# EAGLE design lizard-ttl-register-4bit (EAGLE 6.4)
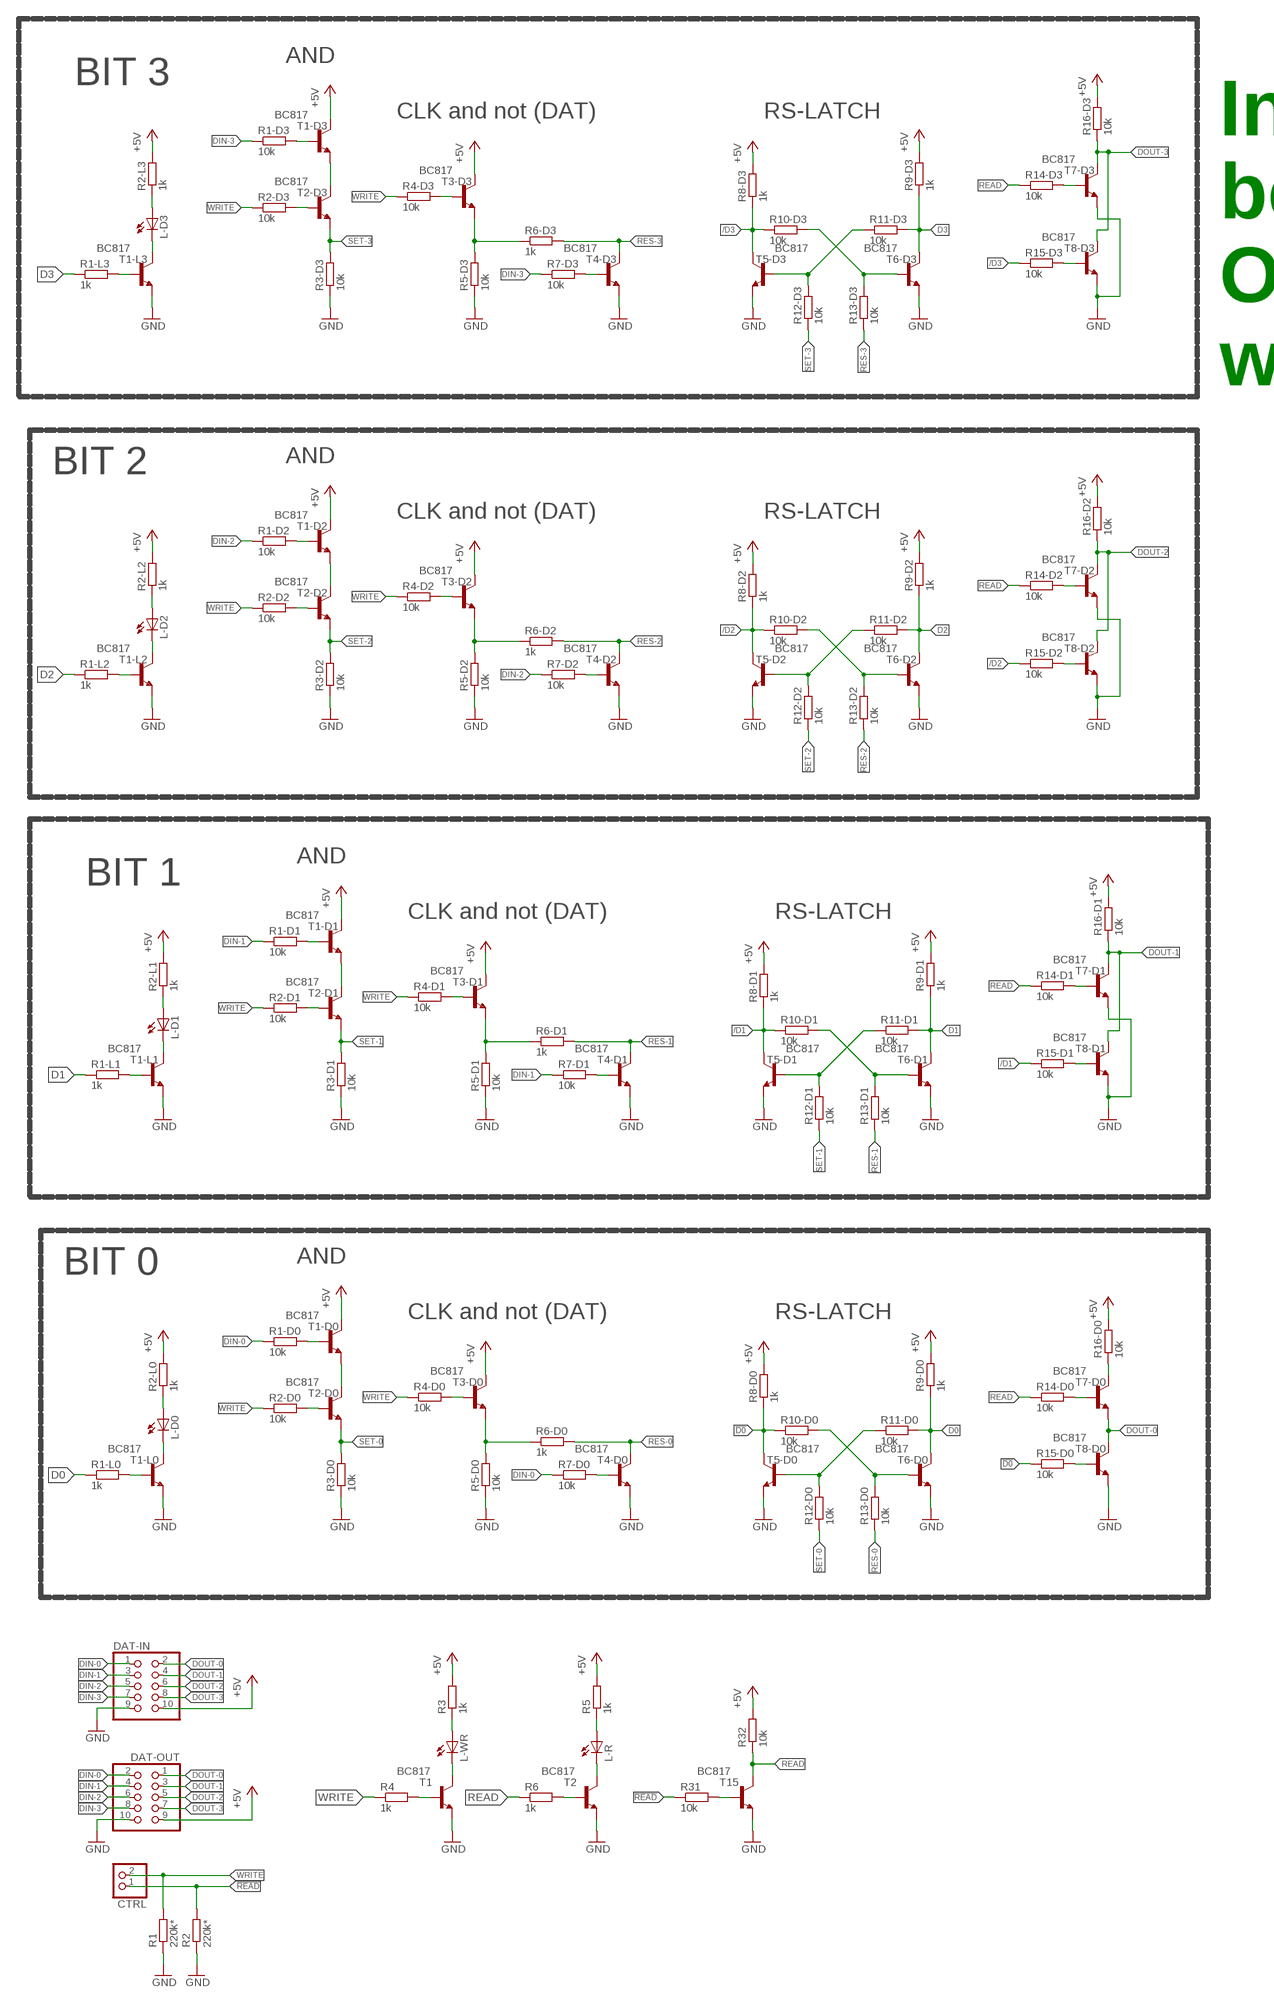
[diagram p0: schematic, sheet 1, part 1 of 2]
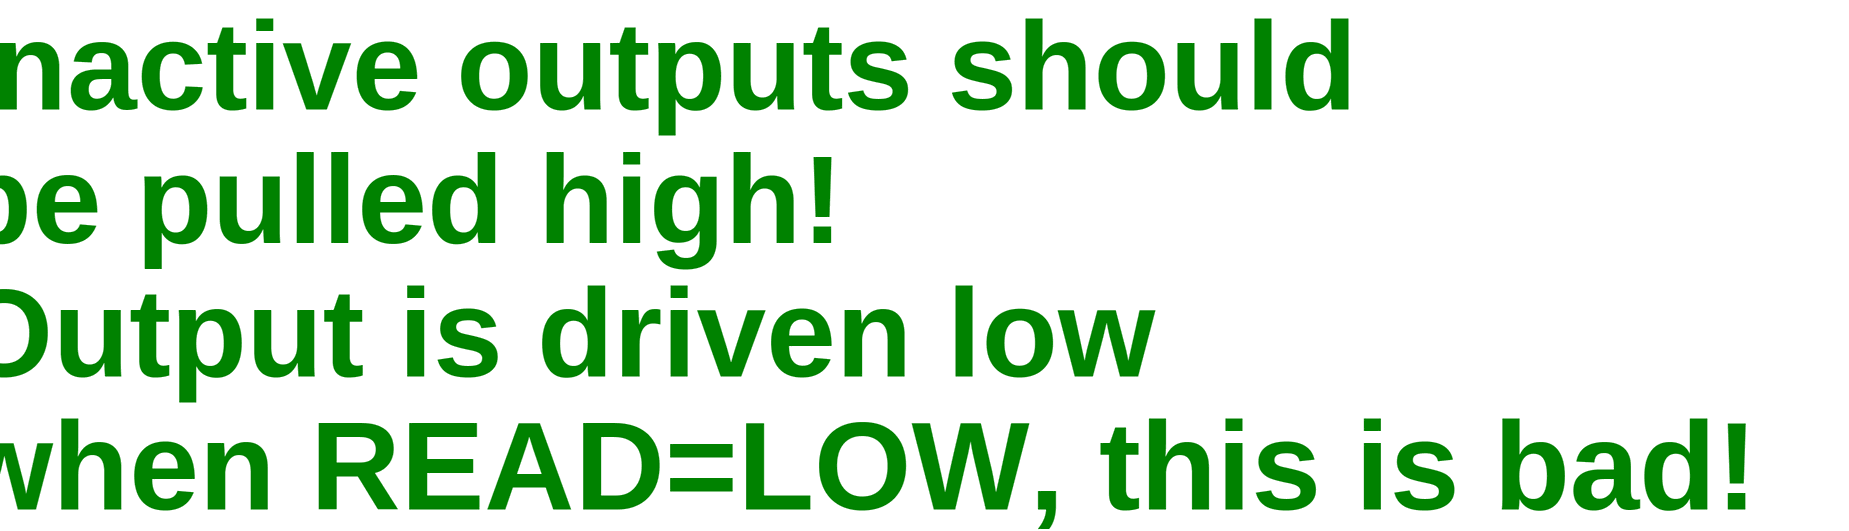
[diagram p1: schematic, sheet 1, part 2 of 2]

## Parts
CTRL  PINHD-1X2  [1X02]
DAT-IN  PINHD-2X5EDGE  [2X05/EDGE]
DAT-OUT  PINHD-2X5EDGE  [2X05/EDGE]
L-D0  LEDCHIPLED_0603  [CHIPLED_0603]
L-D1  LEDCHIPLED_0603  [CHIPLED_0603]
L-D2  LEDCHIPLED_0603  [CHIPLED_0603]
L-D3  LEDCHIPLED_0603  [CHIPLED_0603]
L-R  LEDCHIPLED_0603  [CHIPLED_0603]
L-WR  LEDCHIPLED_0603  [CHIPLED_0603]
R1  220k*  R-EU_R0603  [R0603]
R1-D0  10k  R-EU_R0603  [R0603]
R1-D1  10k  R-EU_R0603  [R0603]
R1-D2  10k  R-EU_R0603  [R0603]
R1-D3  10k  R-EU_R0603  [R0603]
R1-L0  1k  R-EU_R0603  [R0603]
R1-L1  1k  R-EU_R0603  [R0603]
R1-L2  1k  R-EU_R0603  [R0603]
R1-L3  1k  R-EU_R0603  [R0603]
R2  220k*  R-EU_R0603  [R0603]
R2-D0  10k  R-EU_R0603  [R0603]
R2-D1  10k  R-EU_R0603  [R0603]
R2-D2  10k  R-EU_R0603  [R0603]
R2-D3  10k  R-EU_R0603  [R0603]
R2-L0  1k  R-EU_R0603  [R0603]
R2-L1  1k  R-EU_R0603  [R0603]
R2-L2  1k  R-EU_R0603  [R0603]
R2-L3  1k  R-EU_R0603  [R0603]
R3  1k  R-EU_R0603  [R0603]
R3-D0  10k  R-EU_R0603  [R0603]
R3-D1  10k  R-EU_R0603  [R0603]
R3-D2  10k  R-EU_R0603  [R0603]
R3-D3  10k  R-EU_R0603  [R0603]
R4  1k  R-EU_R0603  [R0603]
R4-D0  10k  R-EU_R0603  [R0603]
R4-D1  10k  R-EU_R0603  [R0603]
R4-D2  10k  R-EU_R0603  [R0603]
R4-D3  10k  R-EU_R0603  [R0603]
R5  1k  R-EU_R0603  [R0603]
R5-D0  10k  R-EU_R0603  [R0603]
R5-D1  10k  R-EU_R0603  [R0603]
R5-D2  10k  R-EU_R0603  [R0603]
R5-D3  10k  R-EU_R0603  [R0603]
R6  1k  R-EU_R0603  [R0603]
R6-D0  1k  R-EU_R0603  [R0603]
R6-D1  1k  R-EU_R0603  [R0603]
R6-D2  1k  R-EU_R0603  [R0603]
R6-D3  1k  R-EU_R0603  [R0603]
R7-D0  10k  R-EU_R0603  [R0603]
R7-D1  10k  R-EU_R0603  [R0603]
R7-D2  10k  R-EU_R0603  [R0603]
R7-D3  10k  R-EU_R0603  [R0603]
R8-D0  1k  R-EU_R0603  [R0603]
R8-D1  1k  R-EU_R0603  [R0603]
R8-D2  1k  R-EU_R0603  [R0603]
R8-D3  1k  R-EU_R0603  [R0603]
R9-D0  1k  R-EU_R0603  [R0603]
R9-D1  1k  R-EU_R0603  [R0603]
R9-D2  1k  R-EU_R0603  [R0603]
R9-D3  1k  R-EU_R0603  [R0603]
R10-D0  10k  R-EU_R0603  [R0603]
R10-D1  10k  R-EU_R0603  [R0603]
R10-D2  10k  R-EU_R0603  [R0603]
R10-D3  10k  R-EU_R0603  [R0603]
R11-D0  10k  R-EU_R0603  [R0603]
R11-D1  10k  R-EU_R0603  [R0603]
R11-D2  10k  R-EU_R0603  [R0603]
R11-D3  10k  R-EU_R0603  [R0603]
R12-D0  10k  R-EU_R0603  [R0603]
R12-D1  10k  R-EU_R0603  [R0603]
R12-D2  10k  R-EU_R0603  [R0603]
R12-D3  10k  R-EU_R0603  [R0603]
R13-D0  10k  R-EU_R0603  [R0603]
R13-D1  10k  R-EU_R0603  [R0603]
R13-D2  10k  R-EU_R0603  [R0603]
R13-D3  10k  R-EU_R0603  [R0603]
R14-D0  10k  R-EU_R0603  [R0603]
R14-D1  10k  R-EU_R0603  [R0603]
R14-D2  10k  R-EU_R0603  [R0603]
R14-D3  10k  R-EU_R0603  [R0603]
R15-D0  10k  R-EU_R0603  [R0603]
R15-D1  10k  R-EU_R0603  [R0603]
R15-D2  10k  R-EU_R0603  [R0603]
R15-D3  10k  R-EU_R0603  [R0603]
R16-D0  10k  R-EU_R0603  [R0603]
R16-D1  10k  R-EU_R0603  [R0603]
R16-D2  10k  R-EU_R0603  [R0603]
R16-D3  10k  R-EU_R0603  [R0603]
R31  10k  R-EU_R0603  [R0603]
R32  10k  R-EU_R0603  [R0603]
T1  BC817  BC817-40-NPN-SOT23-BEC  [SOT23-BEC]
T1-D0  BC817  BC817-40-NPN-SOT23-BEC  [SOT23-BEC]
T1-D1  BC817  BC817-40-NPN-SOT23-BEC  [SOT23-BEC]
T1-D2  BC817  BC817-40-NPN-SOT23-BEC  [SOT23-BEC]
T1-D3  BC817  BC817-40-NPN-SOT23-BEC  [SOT23-BEC]
T1-L0  BC817  BC817-40-NPN-SOT23-BEC  [SOT23-BEC]
T1-L1  BC817  BC817-40-NPN-SOT23-BEC  [SOT23-BEC]
T1-L2  BC817  BC817-40-NPN-SOT23-BEC  [SOT23-BEC]
T1-L3  BC817  BC817-40-NPN-SOT23-BEC  [SOT23-BEC]
T2  BC817  BC817-40-NPN-SOT23-BEC  [SOT23-BEC]
T2-D0  BC817  BC817-40-NPN-SOT23-BEC  [SOT23-BEC]
T2-D1  BC817  BC817-40-NPN-SOT23-BEC  [SOT23-BEC]
T2-D2  BC817  BC817-40-NPN-SOT23-BEC  [SOT23-BEC]
T2-D3  BC817  BC817-40-NPN-SOT23-BEC  [SOT23-BEC]
T3-D0  BC817  BC817-40-NPN-SOT23-BEC  [SOT23-BEC]
T3-D1  BC817  BC817-40-NPN-SOT23-BEC  [SOT23-BEC]
T3-D2  BC817  BC817-40-NPN-SOT23-BEC  [SOT23-BEC]
T3-D3  BC817  BC817-40-NPN-SOT23-BEC  [SOT23-BEC]
T4-D0  BC817  BC817-40-NPN-SOT23-BEC  [SOT23-BEC]
T4-D1  BC817  BC817-40-NPN-SOT23-BEC  [SOT23-BEC]
T4-D2  BC817  BC817-40-NPN-SOT23-BEC  [SOT23-BEC]
T4-D3  BC817  BC817-40-NPN-SOT23-BEC  [SOT23-BEC]
T5-D0  BC817  BC817-40-NPN-SOT23-BEC  [SOT23-BEC]
T5-D1  BC817  BC817-40-NPN-SOT23-BEC  [SOT23-BEC]
T5-D2  BC817  BC817-40-NPN-SOT23-BEC  [SOT23-BEC]
T5-D3  BC817  BC817-40-NPN-SOT23-BEC  [SOT23-BEC]
T6-D0  BC817  BC817-40-NPN-SOT23-BEC  [SOT23-BEC]
T6-D1  BC817  BC817-40-NPN-SOT23-BEC  [SOT23-BEC]
T6-D2  BC817  BC817-40-NPN-SOT23-BEC  [SOT23-BEC]
T6-D3  BC817  BC817-40-NPN-SOT23-BEC  [SOT23-BEC]
T7-D0  BC817  BC817-40-NPN-SOT23-BEC  [SOT23-BEC]
T7-D1  BC817  BC817-40-NPN-SOT23-BEC  [SOT23-BEC]
T7-D2  BC817  BC817-40-NPN-SOT23-BEC  [SOT23-BEC]
T7-D3  BC817  BC817-40-NPN-SOT23-BEC  [SOT23-BEC]
T8-D0  BC817  BC817-40-NPN-SOT23-BEC  [SOT23-BEC]
T8-D1  BC817  BC817-40-NPN-SOT23-BEC  [SOT23-BEC]
T8-D2  BC817  BC817-40-NPN-SOT23-BEC  [SOT23-BEC]
T8-D3  BC817  BC817-40-NPN-SOT23-BEC  [SOT23-BEC]
T15  BC817  BC817-40-NPN-SOT23-BEC  [SOT23-BEC]

## Nets
!D0: R8-D0.1 R10-D0.1 R15-D0.1 T5-D0.C
!READ: CTRL.1 R2.2 R31.1
+5V: DAT-IN.10 DAT-OUT.9 R2-L0.2 R2-L1.2 R2-L2.2 R2-L3.2 R3.2 R5.2 R8-D0.2 R8-D1.2 R8-D2.2 R8-D3.2 R9-D0.2 R9-D1.2 R9-D2.2 R9-D3.2 R16-D0.2 R16-D1.2 R16-D2.2 R16-D3.2 R32.2 T1-D0.C T1-D1.C T1-D2.C T1-D3.C T3-D0.C T3-D1.C T3-D2.C T3-D3.C
/D1: R8-D1.1 R10-D1.1 R15-D1.1 T5-D1.C
/D2: R8-D2.1 R10-D2.1 R15-D2.1 T5-D2.C
/D3: R8-D3.1 R10-D3.1 R15-D3.1 T5-D3.C
D0: R1-L0.1 R9-D0.1 R11-D0.2 T6-D0.C
D1: R1-L1.1 R9-D1.1 R11-D1.2 T6-D1.C
D2: R1-L2.1 R9-D2.1 R11-D2.2 T6-D2.C
D3: R1-L3.1 R9-D3.1 R11-D3.2 T6-D3.C
DIN-0: DAT-IN.1 DAT-OUT.2 R1-D0.1 R7-D0.1
DIN-1: DAT-IN.3 DAT-OUT.4 R1-D1.1 R7-D1.1
DIN-2: DAT-IN.5 DAT-OUT.6 R1-D2.1 R7-D2.1
DIN-3: DAT-IN.7 DAT-OUT.8 R1-D3.1 R7-D3.1
DOUT-0: DAT-IN.2 DAT-OUT.1 T7-D0.E T8-D0.C
DOUT-1: DAT-IN.4 DAT-OUT.3 R16-D1.1 T7-D1.C T8-D1.C
DOUT-2: DAT-IN.6 DAT-OUT.5 R16-D2.1 T7-D2.C T8-D2.C
DOUT-3: DAT-IN.8 DAT-OUT.7 R16-D3.1 T7-D3.C T8-D3.C
GND: DAT-IN.9 DAT-OUT.10 R1.1 R2.1 R3-D0.1 R3-D1.1 R3-D2.1 R3-D3.1 R5-D0.1 R5-D1.1 R5-D2.1 R5-D3.1 T1-L0.E T1-L1.E T1-L2.E T1-L3.E T1.E T2.E T4-D0.E T4-D1.E T4-D2.E T4-D3.E T5-D0.E T5-D1.E T5-D2.E T5-D3.E T6-D0.E T6-D1.E T6-D2.E T6-D3.E T7-D1.E T7-D2.E T7-D3.E T8-D0.E T8-D1.E T8-D2.E T8-D3.E T15.E
N$1: T1-D0.E T2-D0.C
N$2: R7-D0.2 T4-D0.B
N$3: R1-L1.2 T1-L1.B
N$4: R4.2 T1.B
N$5: L-WR.A R3.1
N$6: L-WR.C T1.C
N$7: R6.2 T2.B
N$8: L-R.A R5.1
N$9: L-R.C T2.C
N$10: R1-L0.2 T1-L0.B
N$11: L-D0.A R2-L0.1
N$12: L-D0.C T1-L0.C
N$13: L-D1.A R2-L1.1
N$14: R1-D0.2 T1-D0.B
N$15: R2-D0.2 T2-D0.B
N$16: R11-D0.1 R12-D0.2 T5-D0.B
N$17: R10-D0.2 R13-D0.2 T6-D0.B
N$18: L-D1.C T1-L1.C
N$19: R5-D0.2 R6-D0.1 T3-D0.E
N$20: R1-D1.2 T1-D1.B
N$21: R2-D1.2 T2-D1.B
N$22: R5-D1.2 R6-D1.1 T3-D1.E
N$23: R4-D0.2 T3-D0.B
N$24: R4-D1.2 T3-D1.B
N$25: T1-D1.E T2-D1.C
N$26: R7-D1.2 T4-D1.B
N$27: R14-D0.2 T7-D0.B
N$28: R15-D0.2 T8-D0.B
N$29: R31.2 T15.B
N$30: R11-D1.1 R12-D1.2 T5-D1.B
N$31: R10-D1.2 R13-D1.2 T6-D1.B
N$32: R14-D1.2 T7-D1.B
N$33: R15-D1.2 T8-D1.B
N$34: R1-L2.2 T1-L2.B
N$35: L-D2.A R2-L2.1
N$36: L-D2.C T1-L2.C
N$37: R1-D2.2 T1-D2.B
N$38: R2-D2.2 T2-D2.B
N$39: R5-D2.2 R6-D2.1 T3-D2.E
N$40: R4-D2.2 T3-D2.B
N$41: T1-D2.E T2-D2.C
N$42: R7-D2.2 T4-D2.B
N$43: R11-D2.1 R12-D2.2 T5-D2.B
N$44: R10-D2.2 R13-D2.2 T6-D2.B
N$45: R14-D2.2 T7-D2.B
N$46: R15-D2.2 T8-D2.B
N$47: R1-L3.2 T1-L3.B
N$48: L-D3.A R2-L3.1
N$49: L-D3.C T1-L3.C
N$50: R1-D3.2 T1-D3.B
N$51: R2-D3.2 T2-D3.B
N$52: R5-D3.2 R6-D3.1 T3-D3.E
N$53: R4-D3.2 T3-D3.B
N$54: T1-D3.E T2-D3.C
N$55: R7-D3.2 T4-D3.B
N$56: R11-D3.1 R12-D3.2 T5-D3.B
N$57: R10-D3.2 R13-D3.2 T6-D3.B
N$58: R14-D3.2 T7-D3.B
N$59: R15-D3.2 T8-D3.B
N$61: R16-D0.1 T7-D0.C
READ: R6.1 R14-D0.1 R14-D1.1 R14-D2.1 R14-D3.1 R32.1 T15.C
RES-0: R6-D0.2 R13-D0.1 T4-D0.C
RES-1: R6-D1.2 R13-D1.1 T4-D1.C
RES-2: R6-D2.2 R13-D2.1 T4-D2.C
RES-3: R6-D3.2 R13-D3.1 T4-D3.C
SET-0: R3-D0.2 R12-D0.1 T2-D0.E
SET-1: R3-D1.2 R12-D1.1 T2-D1.E
SET-2: R3-D2.2 R12-D2.1 T2-D2.E
SET-3: R3-D3.2 R12-D3.1 T2-D3.E
WRITE: CTRL.2 R1.2 R2-D0.1 R2-D1.1 R2-D2.1 R2-D3.1 R4-D0.1 R4-D1.1 R4-D2.1 R4-D3.1 R4.1

## Notes on the sheet
- AND
- BIT 3
- CLK and not (DAT) | RS-LATCH
- Inactive outputs should
  be pulled high!
  Output is driven low
  when READ=LOW, this is bad!
- AND
- BIT 2
- CLK and not (DAT) | RS-LATCH
- AND
- BIT 1
- CLK and not (DAT) | RS-LATCH
- AND
- BIT 0
- CLK and not (DAT) | RS-LATCH

## Library data of the parts
CTRL = pinhead:PINHD-1X2: PIN HEADER
DAT-IN DAT-OUT = pinhead-mod:PINHD-2X5: PIN HEADER
L-D0 L-D1-L-D3 L-R L-WR = led:LED: LED OSRAM: - CHIPLED LG R971, LG N971, LY N971, LG Q971, LY Q971, LO R971, LY R971 LH N974, LH R974 LS Q976, LO Q976, LY Q976 LO Q996 - Hyper CHIPLED LW Q18S LB Q993, LB Q99A, LB R99A - SideLED LS A670, LO A670, LY A670, LG A670, LP A670 LB A673, LV A673, LT A673, LW A673 LH A674 LY A675 LS A676, LA A676, LO A676, LY A676, LW A676 LS A679, LY A679, LG A679 - Hyper Micro SIDELED® LS Y876, LA Y876, LO Y876, LY Y876 LT Y87S - SmartLED LW L88C, LW L88S LB L89C, LB L89S, LG L890 LS L89K, LO L89K, LY L89K LS L896, LA L896, LO L896, LY L896 - TOPLED LS T670, LO T670, LY T670, LG T670, LP T670 LSG T670, LSP T670, LSY T670, LOP T670, LYG T670 LG T671, LOG T671, LSG T671 LB T673, LV T673, LT T673, LW T673 LH T674 LS T676, LA T676, LO T676, LY T676, LB T676, LH T676, LSB T676, LW T676 LB T67C, LV T67C, LT T67C, LS T67K, LO T67K, LY T67K, LW E67C LS E67B, LA E67B, LO E67B, LY E67B, LB E67C, LV E67C, LT E67C LW T67C LS T679, LY T679, LG T679 LS T770, LO T770, LY T770, LG T770, LP T770 LB T773, LV T773, LT T773, LW T773 LH T774 LS E675, LA E675, LY E675, LS T675 LS T776, LA T776, LO T776, LY T776, LB T776 LHGB T686 LT T68C, LB T68C - Hyper Mini TOPLED® LB M676 - Mini TOPLED Santana® LG M470 LS M47K, LO M47K, LY M47K Source: http://www.osram.convergy.de LUXEON: - LUMILED® LXK2-PW12-R00, LXK2-PW12-S00, LXK2-PW14-U00, LXK2-PW14-V00 LXK2-PM12-R00, LXK2-PM12-S00, LXK2-PM14-U00 LXK2-PE12-Q00, LXK2-PE12-R00, LXK2-PE12-S00, LXK2-PE14-T00, LXK2-PE14-U00 LXK2-PB12-K00, LXK2-PB12-L00, LXK2-PB12-M00, LXK2-PB14-N00, LXK2-PB14-P00, LXK2-PB14-Q00 LXK2-PR12-L00, LXK2-PR12-M00, LXK2-PR14-Q00, LXK2-PR14-R00 LXK2-PD12-Q00, LXK2-PD12-R00, LXK2-PD12-S00 LXK2-PH12-R00, LXK2-PH12-S00 LXK2-PL12-P00, LXK2-PL12-Q00, LXK2-PL12-R00 Source: www.luxeon.com KINGBRIGHT: KA-3528ASYC Source: www.kingbright.com
R1 R1-D0 R1-D1-R1-D3 R1-L0 R1-L1-R1-L3 R2 R2-D0 R2-D1-R2-D3 R2-L0 R2-L1-R2-L3 R3 R3-D0 R3-D1-R3-D3 R4 R4-D0 R4-D1-R4-D3 R5 R5-D0 R5-D1-R5-D3 R6 R6-D0 R6-D1-R6-D3 R7-D0 R7-D1-R7-D3 R8-D0 R8-D1-R8-D3 R9-D0 R9-D1-R9-D3 R10-D0 R10-D1-R10-D3 R11-D0 R11-D1-R11-D3 R12-D0 R12-D1-R12-D3 R13-D0 R13-D1-R13-D3 R14-D0 R14-D1-R14-D3 R15-D0 R15-D1-R15-D3 R16-D0 R16-D1-R16-D3 R31 R32 = p.peter-rcl:R-EU_: RESISTOR, European symbol
T1 T1-D0 T1-D1-T1-D3 T1-L0 T1-L1-T1-L3 T2 T2-D0 T2-D1-T2-D3 T3-D0 T3-D1-T3-D3 T4-D0 T4-D1-T4-D3 T5-D0 T5-D1-T5-D3 T6-D0 T6-D1-T6-D3 T7-D0 T7-D1-T7-D3 T8-D0 T8-D1-T8-D3 T15 = transistor:*-NPN-: NPN Transistror BF959 corrected 2008.03.06

## Board
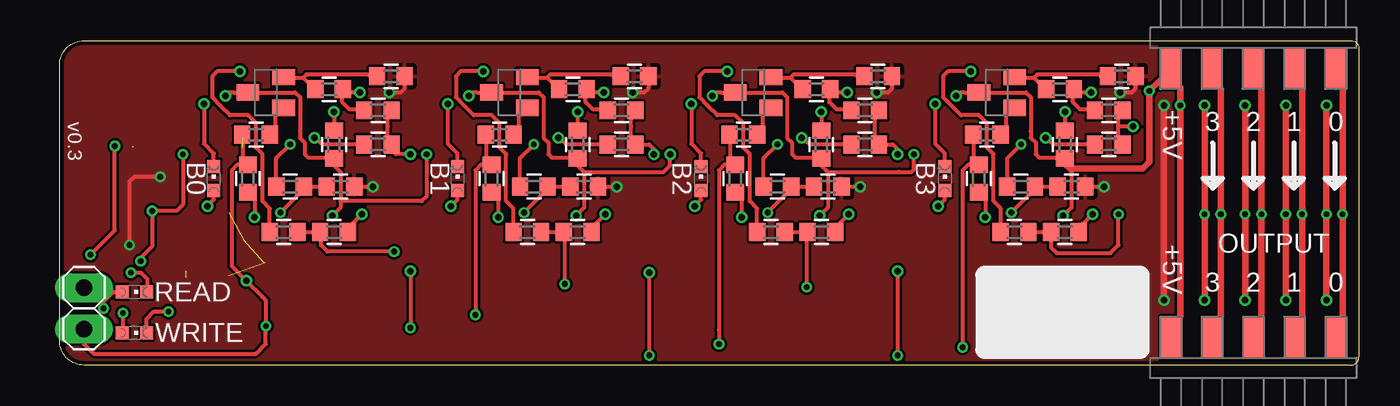
[diagram p2: board, top side]
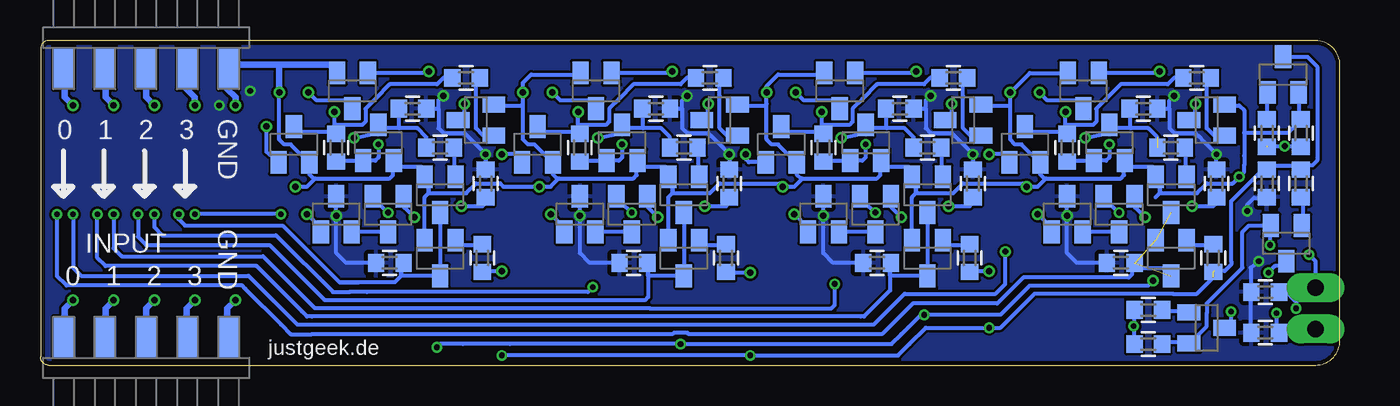
[diagram p3: board, bottom side, seen from below]

Size 80 x 20 mm. Coordinates in mm from the lower left corner, seen from the top.
Outline: 0,1.5 0,18.5 arc-90 1.5,20 2,20 79.5,20 arc-90 80,19.5 80,0.5 arc-90 79.5,0 1.5,0 arc-90 0,1.5
Copper layers (1*16): Top 0.035mm / dielectric 1.5mm / Bottom 0.035mm
Design rules "Fusion_eagle_rule_v1.1 *": minimum track width 6mil, minimum drill 12mil, track to track 6mil, track to pad 6mil, pad to pad 6mil, via to via 6mil, smd to smd 0mil, copper to edge 10mil, drill to drill 10mil, minimum pad ring 15mil, minimum via ring 6mil, stop-mask expansion 2mil, vias tented up to drill 100mil, thermal gap 10mil

### Footprints (pad centres in the part's own frame; a part is rotated, then mirrored left to right if it is on the bottom)
1X02 = drill 1.016 long: 1 -1.27,0; 2 1.27,0
2X05/EDGE = smd 1.27 x 2.54: 1 5.08,1.73; 3 2.54,1.73; 5 0,1.73; 7 -2.54,1.73; 9 -5.08,1.73 | smd 1.27 x 2.54 bottom: 2 5.08,1.73; 4 2.54,1.73; 6 0,1.73; 8 -2.54,1.73; 10 -5.08,1.73
CHIPLED_0603 = smd 0.8 x 0.8: A 0,-0.75; C 0,0.75
R0603 = smd 1 x 1.1: 1 -0.85,0; 2 0.85,0
SOT23-BEC = smd 1 x 1.4: B -0.95,-1.1; C 0,1.1; E 0.95,-1.1

### Placement (x,y rotation side)
CTRL  1.5,3.5 270 top
DAT-IN  73.5,20 180 bottom
DAT-OUT  73.5,0 0 top
L-D0  9.5,11.5 0 top
L-D1  24.5,11.5 0 top
L-D2  39.5,11.5 0 top
L-D3  54.5,11.5 0 top
L-R  4.6,4.5 270 top
L-WR  4.6,2 270 top
R1  11.8,1.3 180 bottom
R1-D0  16.9,8.2 0 top
R1-D1  31.9,8.2 0 top
R1-D2  46.9,8.2 0 top
R1-D3  61.9,8.2 0 top
R1-L0  8.8,17.7 0 bottom
R1-L1  23.8,17.7 0 bottom
R1-L2  38.8,17.7 0 bottom
R1-L3  53.8,17.7 0 bottom
R2  2.4,14.3 270 bottom
R2-D0  11.6,11.5 270 top
R2-D1  26.6,11.5 270 top
R2-D2  41.6,11.5 270 top
R2-D3  56.6,11.5 270 top
R2-L0  7.6,11.2 90 bottom
R2-L1  22.6,11.2 90 bottom
R2-L2  37.6,11.2 90 bottom
R2-L3  52.6,11.2 90 bottom
R3  4.6,2 180 bottom
R3-D0  17.3,11 180 top
R3-D1  32.3,11 180 top
R3-D2  47.3,11 180 top
R3-D3  62.3,11 180 top
R4  11.8,3.4 0 bottom
R4-D0  12.1,14.2 0 top
R4-D1  27.1,14.2 0 top
R4-D2  42.1,14.2 0 top
R4-D3  57.1,14.2 0 top
R5  4.6,4.5 180 bottom
R5-D0  20.4,17.8 180 top
R5-D1  35.4,17.8 180 top
R5-D2  50.4,17.8 180 top
R5-D3  65.4,17.8 180 top
R6  2.4,11.2 270 bottom
R6-D0  16.6,17 0 top
R6-D1  31.6,17 0 top
R6-D2  46.6,17 0 top
R6-D3  61.6,17 0 top
R7-D0  13.8,8.2 180 top
R7-D1  28.8,8.2 180 top
R7-D2  43.8,8.2 180 top
R7-D3  58.8,8.2 180 top
R8-D0  12.1,15.8 0 bottom
R8-D1  27.1,15.8 0 bottom
R8-D2  42.1,15.8 0 bottom
R8-D3  57.1,15.8 0 bottom
R9-D0  16.9,13.6 270 top
R9-D1  31.9,13.6 270 top
R9-D2  46.9,13.6 270 top
R9-D3  61.9,13.6 270 top
R10-D0  19.6,13.6 0 top
R10-D1  34.6,13.6 0 top
R10-D2  49.6,13.6 0 top
R10-D3  64.6,13.6 0 top
R11-D0  16.8,13.4 90 bottom
R11-D1  31.8,13.4 90 bottom
R11-D2  46.8,13.4 90 bottom
R11-D3  61.8,13.4 90 bottom
R12-D0  14.2,11 180 top
R12-D1  29.2,11 180 top
R12-D2  44.2,11 180 top
R12-D3  59.2,11 180 top
R13-D0  19.6,15.7 0 top
R13-D1  34.6,15.7 0 top
R13-D2  49.6,15.7 0 top
R13-D3  64.6,15.7 0 top
R14-D0  7.8,6.6 90 bottom
R14-D1  22.8,6.6 90 bottom
R14-D2  37.8,6.6 90 bottom
R14-D3  52.8,6.6 90 bottom
R15-D0  10.4,13.4 0 bottom
R15-D1  25.4,13.4 0 bottom
R15-D2  40.4,13.4 0 bottom
R15-D3  55.4,13.4 0 bottom
R16-D0  13.5,6.3 180 bottom
R16-D1  28.5,6.3 180 bottom
R16-D2  43.5,6.3 180 bottom
R16-D3  58.5,6.3 180 bottom
R31  4.5,14.3 90 bottom
R32  4.5,11.2 270 bottom
T1  8.2,2.3 270 bottom
T1-D0  16.8,9.3 0 bottom
T1-D1  31.8,9.3 0 bottom
T1-D2  46.8,9.3 0 bottom
T1-D3  61.8,9.3 0 bottom
T1-L0  8.2,15.1 90 bottom
T1-L1  23.2,15.1 90 bottom
T1-L2  38.2,15.1 90 bottom
T1-L3  53.2,15.1 90 bottom
T2  3.3,7.5 180 bottom
T2-D0  13.6,9.3 180 bottom
T2-D1  28.6,9.3 180 bottom
T2-D2  43.6,9.3 180 bottom
T2-D3  58.6,9.3 180 bottom
T3-D0  12.7,16.8 90 top
T3-D1  27.7,16.8 90 top
T3-D2  42.7,16.8 90 top
T3-D3  57.7,16.8 90 top
T4-D0  15.8,16.9 180 bottom
T4-D1  30.8,16.9 180 bottom
T4-D2  45.8,16.9 180 bottom
T4-D3  60.8,16.9 180 bottom
T5-D0  14.2,13.7 0 bottom
T5-D1  29.2,13.7 0 bottom
T5-D2  44.2,13.7 0 bottom
T5-D3  59.2,13.7 0 bottom
T6-D0  19.4,13.6 0 bottom
T6-D1  34.4,13.6 0 bottom
T6-D2  49.4,13.6 0 bottom
T6-D3  64.4,13.6 0 bottom
T7-D0  10.4,6.6 180 bottom
T7-D1  25.4,6.6 180 bottom
T7-D2  40.4,6.6 180 bottom
T7-D3  55.4,6.6 180 bottom
T8-D0  10.4,10.5 180 bottom
T8-D1  25.4,10.5 180 bottom
T8-D2  40.4,10.5 180 bottom
T8-D3  55.4,10.5 180 bottom
T15  3.5,17.9 0 bottom
U$1  [LOGO-JUSTGEEK-XS-MASK]  3,17 0 top

### Tracks (layer width: path | path; a pad name or v marks a point on that pad's centre or on a via)
!D0  (via drill 0.4)  (1 unrouted)
  Top 0.25: R10-D0.1 16.2,13.6 v15.7,14
  Bottom 0.25: v15.7,14 14.3,14.3 14.2,14.4 T5-D0.C 14,14.6 12.9,14.6 | 11.25,14.05 11.8,14.6 12.9,14.6 | R8-D0.1 12.95,14.65 12.9,14.6
!READ  (via drill 0.35)  (1 unrouted)
  Top 0.25: v1.9,6.8 3.4,8.3 v3.4,13.5
  Bottom 0.25: 2.6,13.2 2.4,13.4 R2.2 2.45,13.4 2.6,13.4 2.65,13.45 2.7,13.5 v3.4,13.5 4.5,13.5 | CTRL.1 1.5,6.4 v1.9,6.8
+5V  (via drill 0.35, 0.4)
  Top 0.25: 17.3,10.1 17.3,11.9 16.8,12.4 R9-D0.2 16.75,12.8 15.3,12.8 15.1,13 15.1,13.7 14.8,14 14.8,14.4 14.8,16.5 14.5,16.8 T3-D0.C 10.7,16.8 10.4,16.8 v10.2,16.6 | 17.3,10.1 17.3,9.7 v16.8,9.2 | 32.3,11.9 31.8,12.4 R9-D1.2 31.75,12.8 30.3,12.8 30.1,13 30.1,13.7 29.8,14 29.8,14.4 29.8,16.5 29.5,16.8 T3-D1.C 25.7,16.8 25.4,16.8 v25.2,16.6 | 32.3,11.9 32.3,9.7 v31.8,9.2 | 32.3,11.9 37.2,11.9 37.6,12.3 v37.6,13 | 47.3,11.9 46.8,12.4 R9-D2.2 46.75,12.8 45.3,12.8 45.1,13 45.1,13.7 44.8,14 44.8,14.4 44.8,16.5 44.5,16.8 T3-D2.C 40.7,16.8 40.4,16.8 v40.2,16.6 | 47.3,11.9 47.3,9.7 v46.8,9.2 | 47.3,11.9 51.7,11.9 52.45,11.9 R2-L3.2 v52.6,13 | 61.9,12.4 R9-D3.2 61.75,12.8 60.3,12.8 60.1,13 60.1,13.7 59.8,14 59.8,14.4 59.8,16.5 59.5,16.8 T3-D3.C 55.7,16.8 55.4,16.8 v55.2,16.6 | 62.2,12.1 62.3,12 62.3,9.7 v61.8,9.2 | v22.6,13 22.6,10.4 22.3,10.1 17.3,10.1 | v5,6.4 5,6.6 5.7,7.3 v5.7,9.5 7.2,9.5 7.6,9.9 v7.6,13
  Top 0.4: DAT-IN.10 68.42,17.58 | 68.42,17.58 69,17.1 | 69,17.1 v69,16 69,3 68.5,2.5 68.5,1.81 DAT-OUT.9 | 68.42,17.58 69,17.1 | 61.9,12.4 62.2,12.1 66.7,12.1 67.1,12.5 v67.1,16.9 67.7,17.5 68.34,17.5 68.42,17.58
  Bottom 0.25: T1-D0.C v16.8,9.2 16.8,6.9 16.2,6.3 R16-D0.2 | R8-D0.2 10.5,15.8 | 10.5,15.8 10.5,14.6 10.2,14.3 8.9,14.3 8.7,14.1 8.4,13.8 v7.6,13 R2-L0.2 | 10.5,15.8 10.5,16.3 v10.2,16.6 | T1-D1.C v31.8,9.2 31.8,6.9 31.2,6.3 R16-D1.2 | R8-D1.2 25.5,15.8 | 25.5,15.8 25.5,14.6 25.2,14.3 23.9,14.3 23.7,14.1 23.4,13.8 v22.6,13 R2-L1.2 | 25.5,15.8 25.5,16.3 v25.2,16.6 | T1-D2.C v46.8,9.2 46.8,6.9 46.2,6.3 R16-D2.2 | R8-D2.2 40.5,15.8 | 40.5,15.8 40.5,14.6 40.2,14.3 38.9,14.3 38.7,14.1 38.4,13.8 v37.6,13 R2-L2.2 | 40.5,15.8 40.5,16.3 v40.2,16.6 | T1-D3.C v61.8,9.2 61.8,6.9 61.2,6.3 R16-D3.2 | R8-D3.2 55.5,15.8 | 55.5,15.8 55.5,14.6 55.2,14.3 53.9,14.3 53.7,14.1 53.4,13.8 v52.6,13 R2-L3.2 | 55.5,15.8 55.5,16.3 v55.2,16.6 | R3.2 5.5,2 5.5,4.45 R5.2 | 5.7,4.8 5.7,4.75 | 5.7,4.75 R5.2 | v5,6.4 5.5,6 5.5,4.7 5.55,4.75 5.7,4.75 | 5.7,4.75 R5.2 | v5.7,9.5 5.7,9.9 5.3,10.3 4.55,10.3 R32.2
  pour Bottom (isolate 0.15): 0,0 0,20 80,20 80,0
/D1  (via drill 0.4)
  Top 0.25: R10-D1.1 31.2,13.6 v30.7,14
  Bottom 0.25: v30.7,14 29.3,14.3 29.2,14.4 T5-D1.C 29,14.6 27.9,14.6 | R15-D1.1 26.25,14.05 26.8,14.6 27.9,14.6 | R8-D1.1 27.95,14.65 27.9,14.6
/D2  (via drill 0.4)
  Top 0.25: R10-D2.1 46.2,13.6 v45.7,14
  Bottom 0.25: v45.7,14 44.3,14.3 44.2,14.4 T5-D2.C 44,14.6 42.9,14.6 | R15-D2.1 41.25,14.05 41.8,14.6 42.9,14.6 | R8-D2.1 42.95,14.65 42.9,14.6
/D3  (via drill 0.4)
  Top 0.25: R10-D3.1 61.2,13.6 v60.7,14
  Bottom 0.25: v60.7,14 59.3,14.3 59.2,14.4 T5-D3.C 59,14.6 57.9,14.6 | R15-D3.1 56.25,14.05 56.8,14.6 57.9,14.6 | R8-D3.1 57.95,14.65 57.9,14.6
D0  (via drill 0.4)
  Top 0.25: v16.9,15.6 R9-D0.1
  Bottom 0.25: T6-D0.C 19.4,14.5 19.3,14.4 16.85,14.4 R11-D0.2 16.9,14.5 16.9,14.8 | 16.9,14.8 v16.9,15.6 | 16.9,14.8 15.2,14.8 15,15 15,15.8 14.4,16.4 13.5,17.3 10.6,17.3 10.2,17.7 R1-L0.1
D1  (via drill 0.4)
  Top 0.25: v31.9,15.6 R9-D1.1
  Bottom 0.25: T6-D1.C 34.4,14.5 34.3,14.4 31.85,14.4 R11-D1.2 31.9,14.5 31.9,14.8 | 31.9,14.8 v31.9,15.6 | 31.9,14.8 30.2,14.8 30,15 30,15.8 29.4,16.4 28.5,17.3 25.6,17.3 25.2,17.7 R1-L1.1
D2  (via drill 0.4)
  Top 0.25: v46.9,15.6 R9-D2.1
  Bottom 0.25: T6-D2.C 49.4,14.5 49.3,14.4 46.85,14.4 R11-D2.2 46.9,14.5 46.9,14.8 | 46.9,14.8 v46.9,15.6 | 46.9,14.8 45.2,14.8 45,15 45,15.8 44.4,16.4 43.5,17.3 40.6,17.3 40.2,17.7 R1-L2.1
D3  (via drill 0.4)
  Top 0.25: v61.9,15.6 R9-D3.1
  Bottom 0.25: T6-D3.C 64.4,14.5 64.3,14.4 61.85,14.4 R11-D3.2 61.9,14.5 61.9,14.8 | 61.9,14.8 v61.9,15.6 | 61.9,14.8 60.2,14.8 60,15 60,15.8 59.4,16.4 58.5,17.3 55.6,17.3 55.2,17.7 R1-L3.1
DIN-0  (via drill 0.35, 0.4)
  Top 0.25: R7-D0.1 16,8.2 | 16,8.2 R1-D0.1 | R1-D0.1 16,8.2 | v20.6,7 16.5,7 16.1,7.4 16.1,8.15 R1-D0.1
  Top 0.4: v78,4 v78,9.3 v78,16
  Bottom 0.25: 78.5,18.19 78.5,18 78.5,18.27 DAT-IN.1 | v20.6,7 20.6,5 21.2,4.4 26.8,4.4 28.7,2.5 64.1,2.5 64.2,2.5 64.6,2.9 67.2,5.5 77.5,5.5 78,6 v78,9.3
  Bottom 0.4: DAT-OUT.2 78.58,1.92 78.5,2 78.5,3.5 v78,4 | v78,16 78.5,16.5 78.5,18
DIN-1  (via drill 0.35, 0.4)
  Top 0.25: R7-D1.1 29.6,8.2 R1-D1.1 31.05,8.15 31.1,8.1 v31.1,5
  Top 0.4: v75.5,16 v75.5,9.3 v75.5,4
  Bottom 0.25: v31.1,5 31.1,3.7 31.3,3.5 42.5,3.5 63.1,3.5 63.3,3.7 66.3,6.7 75,6.7 75.5,7.2 v75.5,9.3
  Bottom 0.4: v75.5,16 76,16.5 76,17 76.04,17.04 DAT-IN.3 | v75.5,4 76,3.5 76,1.77 DAT-OUT.4
DIN-2  (via drill 0.35, 0.4)
  Top 0.25: R7-D2.1 46,8.2 | 46,8.2 R1-D2.1 | R1-D2.1 46,8.2 | R1-D2.1 46.05,7.95 46,7.9 v46,4.8
  Top 0.4: v73,16 v73,9.3 v73,4
  Bottom 0.25: v46,4.8 46.3,4.5 59.9,4.5 61,4.5 62,4.5 65.5,8 72.5,8 73,8.5 v73,9.3
  Bottom 0.4: v73,16 73.5,16.5 73.5,17.5 DAT-IN.5 | v73,4 73.5,3.5 DAT-OUT.6
DIN-3  (via drill 0.35, 0.4)
  Top 0.25: R1-D3.1 61,8.2 | R7-D3.1 59.6,8.2 R1-D3.1 | R1-D3.1 61.05,7.25 61.4,6.9 61.5,6.9 64.7,6.9 65.2,7.4 v65.2,9.3
  Top 0.4: v70.5,4 v70.5,9.3 v70.5,16
  Bottom 0.25: DAT-IN.7 71,18.27 71,18.23 | v65.2,9.3 v70.5,9.3
  Bottom 0.4: DAT-OUT.8 70.96,2.46 71,2.5 71,3.5 v70.5,4 | v70.5,16 70.5,16.5 71,17 71,18.23
DOUT-0  (via drill 0.35)  (2 unrouted)
  Top 0.4: DAT-OUT.1 78.85,2 79,2 v79,9.3 79,18 78.73,18.27 DAT-IN.2
  Bottom 0.25: 12.6,6.1 12.8,6.3 12.8,6 12.8,5.6 13,5.4 19.5,5.4 21.1,3.8 26.3,3.8 28.2,1.9 40.1,1.9 40.2,2 41,2 41.1,1.9 63.3,1.9 64.6,1.9 65.2,2.5 67.4,4.7 67.6,4.9 78.4,4.9 79,5.5 v79,9.3 | 12.6,6.1 12.6,6.25 12.6,6.3 12.7,6.4 12.7,6.2 12.6,6.1 | 12.6,6.1 12.6,6 10.4,6
DOUT-1  (via drill 0.35)
  Top 0.4: DAT-OUT.3 76.23,1.73 76.5,2 v76.5,9.3 76.5,17.5 76.5,17.81 76.5,18.27 DAT-IN.4
  Bottom 0.25: T8-D1.C T7-D1.C 27.7,5.5 | 27.6,6.1 27.8,6.3 | 27.8,6.3 27.8,6 27.7,6.1 | 27.7,5.5 27.7,6.1 | 27.7,6.1 27.7,6.25 R16-D1.1 27.6,6.25 27.6,6.2 27.7,6.1 | 27.8,6.3 27.8,6.2 27.7,6.1 | 27.7,6.1 27.7,5.5 | 27.7,5.5 27.7,4.6 29.3,3 29.5,3 63.3,3 63.6,3 63.9,3.3 66.7,6.1 76,6.1 76.5,6.6 v76.5,9.3
DOUT-2  (via drill 0.35)
  Top 0.4: DAT-OUT.5 73.5,2.5 74,3 v74,9.3 74,17 73.5,17.5 DAT-IN.6
  Bottom 0.25: T8-D2.C T7-D2.C 42.6,5.5 | 42.6,6.1 42.6,5.8 42.6,5.5 | 42.6,6.1 42.6,6.25 | 42.6,6.25 R16-D2.1 42.6,6.25 | 42.6,6.1 42.8,6.3 | 42.8,6.3 42.8,6 | 42.6,6.1 42.6,6.25 | 42.8,6.3 42.6,6.3 42.6,5.5 | 42.6,5.5 42.6,4.2 42.8,4 47,4 62.5,4 62.6,4.1 65.9,7.4 73.5,7.4 74,7.9 v74,9.3
DOUT-3  (via drill 0.35)
  Top 0.4: 70.96,17.54 71,17.5 | 71,17.5 71.5,17 v71.5,9.3 71.5,3 71,2.5 71,1.77 DAT-OUT.7 | DAT-IN.8 71,18.27 71,17.5
  Bottom 0.25: T8-D3.C T7-D3.C 57.8,5.5 | 57.8,5.5 57.8,6.1 | 57.8,6.1 57.7,6.25 R16-D3.1 | 57.8,6.1 57.6,6.1 57.8,6.3 57.8,6.1 | 57.8,6.1 57.8,5.5 | 57.8,5.5 58.2,5.1 60.4,5.1 | 60.4,5.1 61.6,5.1 | 61.6,5.1 60.4,5.1 | v71.5,9.3 71.5,9 71.1,8.6 65.1,8.6 61.6,5.1
GND  (via drill 0.35, 0.4)
  Top 0.25: R3-D0.1 v19.3,11 | R5-D0.1 21.25,17.05 21,16.8 v20.3,16.8 | R3-D1.1 v34.3,11 | R5-D1.1 36.25,17.05 36,16.8 v35.3,16.8 | R3-D2.1 v49.3,11 | R5-D2.1 51.25,17.05 51,16.8 v50.3,16.8 | R3-D3.1 v64.3,11 | R5-D3.1 66.25,17.05 66,16.8 v65.3,16.8 | v6.2,11.6 4.6,11.6 4.3,11.3 v4.3,7.4
  Top 0.4: v68,4 v68,16
  Bottom 0.25: 68.5,18.19 DAT-IN.9 68.19,18.5 67.9,18.5 | 18.1,11.5 18.2,11.5 18.45,11.75 T6-D0.E 18.5,12.5 19.6,13.6 20,13.6 20.3,13.9 20.3,16 | 18.1,11.5 13.5,11.5 13.3,11.7 13.3,12.3 | 13.3,12.3 13.3,12.55 T5-D0.E | 20.3,16 v20.3,16.8 19.1,18 T4-D0.E | 18.1,11.5 18.6,11 v19.3,11 19.5,11.2 21.9,11.2 23.2,11.2 23.8,10.6 26.1,10.6 | 11.35,12.05 T8-D0.E 11.1,11.35 11.1,11.3 | 11.35,12.05 11.5,12.2 13.2,12.2 13.3,12.3 | 11.35,10.35 11.1,10.6 | 11.1,10.6 11.1,11.3 | 11.35,12.05 11.35,11.55 11.1,11.3 | 11.1,11.3 11.1,10.6 | 11.1,10.6 8.8,10.6 8.2,11.2 6.9,11.2 6.6,11.2 | 7.15,16 T1-L0.E 7.05,16 6.2,16 5.9,15.7 5.9,14.3 | 5.9,14.3 5.9,12.9 5.9,12.3 5.9,11.9 v6.2,11.6 | 33.1,11.5 33.2,11.5 33.45,11.75 T6-D1.E 33.5,12.5 34.6,13.6 35,13.6 35.3,13.9 35.3,16.1 | 33.1,11.5 28.5,11.5 28.3,11.7 28.3,12.3 | 28.3,12.3 28.3,12.55 T5-D1.E | 35.3,16.1 v35.3,16.8 35.3,17.2 34.6,17.9 31.85,17.9 T4-D1.E | 33.1,11.5 33.6,11 v34.3,11 34.5,11.2 36.9,11.2 38.2,11.2 38.8,10.6 41.1,10.6 | 26.35,12.05 T8-D1.E 26.1,11.35 26.1,11.3 | 26.35,12.05 26.5,12.2 28.2,12.2 28.3,12.3 | T7-D1.E 26.35,10.35 26.1,10.6 | 26.1,10.6 26.1,11.3 | 26.35,12.05 26.35,11.55 26.1,11.3 | 26.1,11.3 26.1,10.6 | 22.15,16 T1-L1.E | 22.05,16 T1-L1.E | 48.1,11.5 48.2,11.5 48.45,11.75 T6-D2.E 48.5,12.5 49.6,13.6 50,13.6 50.3,13.9 50.3,15.9 | 48.1,11.5 43.5,11.5 43.3,11.7 43.3,12.3 | 43.3,12.3 43.3,12.55 T5-D2.E | 50.3,15.9 v50.3,16.8 50.3,17.4 49.8,17.9 46.85,17.9 T4-D2.E | 48.1,11.5 48.6,11 v49.3,11 51.5,11 51.7,11.2 51.9,11.2 53.2,11.2 53.8,10.6 56.1,10.6 | 41.35,12.05 T8-D2.E 41.1,11.35 41.1,11.3 | 41.35,12.05 41.5,12.2 43.2,12.2 43.3,12.3 | T7-D2.E 41.35,10.35 41.1,10.6
  Bottom 0.25: 41.1,10.6 41.1,11.3 | 41.35,12.05 41.35,11.55 41.1,11.3 | 41.1,11.3 41.1,10.6 | 37.15,16 T1-L2.E 37.05,16 37,16 35.4,16 35.3,16.1 | 63.1,11.5 63.2,11.5 63.45,11.75 T6-D3.E 63.5,12.5 64.6,13.6 65,13.6 65.3,13.9 v65.3,16.8 | 63.1,11.5 58.5,11.5 58.3,11.7 58.3,12.3 | 58.3,12.3 58.3,12.55 T5-D3.E | v64.3,11 63.6,11 63.1,11.5 | 56.35,12.05 T8-D3.E 56.1,11.35 56.1,11.3 | 56.35,12.05 56.5,12.2 58.2,12.2 58.3,12.3 | T7-D3.E 56.35,10.35 56.1,10.6 | 56.1,10.6 56.1,11.3 | 56.35,12.05 56.35,11.55 56.1,11.3 | 56.1,11.3 56.1,10.6 | 52.15,16 T1-L3.E | 52.05,16 T1-L3.E | T1-L1.E 22.05,16 | 22.05,16 20.3,16 | T1-L3.E 52.05,16.05 52,16 50.4,16 50.3,15.9 | T15.E 2.55,16.55 2.5,16.5 2.5,15.3 2.5,15.25 R2.1 2.4,14.9 2.6,14.9 3.2,14.3 3.8,14.3 5.9,14.3 | T2.E 4.4,8.6 | 6.6,11.2 v6.2,11.6 | 6.6,11.2 v6.2,11.6 | v4.3,7.4 4.3,8.55 T2.E | T2.E 5.6,8.6 6,8.2 6,6 8.2,3.8 8.2,3.2 8.2,2.4 9,1.6 9.1,1.6 9.1,1.55 T1.E 9.45,1.35 9.5,1.4 10.85,1.4 R1.1
  Bottom 0.4: DAT-OUT.10 68.42,2.42 68.5,2.5 68.5,3.5 v68,4 | v68,16 68,16.5 68.5,17 68.5,18.19 | v65.3,16.8 65.3,18.5 | 65.3,18.5 65,18.5 62.8,18.5 62.25,18.5 T4-D3.E | 65.3,18.5 67.9,18.5
  pour Top (isolate 0.15): 0,0 0,20 80,20 80,0
N$1
  Bottom 0.25: T2-D0.C T1-D0.E
N$2  (via drill 0.4)
  Top 0.25: R7-D0.2 12.95,9.65 12.5,10.1 12.5,13 12.1,13.4 12.1,14.9 11.6,15.4 10.5,15.4 9.9,16 9.4,16.5 9.4,17.8 9.7,18.1 v11.1,18.1
  Bottom 0.25: v11.1,18.1 11.2,18 T4-D0.B
N$3
  Bottom 0.25: 22.05,14.1 T1-L1.B 22.75,14.15 23.2,14.6 23.2,16.6 23.2,17.6 23.1,17.7 R1-L1.2
N$4
  Bottom 0.25: T1.B 9.3,3.2 9.4,3.1 9.4,3.3 10.85,3.3 R4.2
N$5  (via drill 0.35)
  Top 0.25: v3.9,3.2 3.9,2.05 L-WR.A
  Bottom 0.25: R3.1 L-WR.A 3.85,2.25 3.9,2.3 v3.9,3.2
N$6  (via drill 0.35)
  Top 0.25: L-WR.C 5.35,2.85 5.8,3.3 v6.7,3.3
  Bottom 0.25: T1.C 6.7,2.3 | 6.7,2.3 7.7,2.3 | 6.7,2.3 v6.7,3.3
N$7
  Bottom 0.25: R6.2 2.35,10.35 2.3,10.4 2.3,8.65 T2.B
N$8  (via drill 0.35)
  Top 0.25: L-R.A R5.1 | R5.1 3.75,4.65 3.9,4.8 | v2.7,3.5 2.7,3.9 3.3,4.5 R5.1
  Bottom 0.25: 3.9,4.65 R5.1 3.3,4.5 2.8,4 2.7,3.9 v2.7,3.5
N$9  (via drill 0.35)
  Top 0.25: 5.4,4.55 L-R.C | 5.3,4.65 L-R.C | 5.3,4.55 L-R.C | v4.4,5.7 5,5.7 5.4,5.3 5.4,4.55 | 5.4,4.55 L-R.C
  Bottom 0.25: T2.C 3.3,6.1 4,6.1 v4.4,5.7
N$10
  Bottom 0.25: 7.05,14.1 T1-L0.B 7.75,14.15 8.2,14.6 8.2,16.6 8.2,17.6 8.1,17.7 R1-L0.2
N$11  (via drill 0.4)
  Top 0.25: v9.1,9.8 9.5,10.2 L-D0.A
  Bottom 0.25: v9.1,9.8 7.8,9.8 7.6,10 R2-L0.1
N$12  (via drill 0.4)
  Top 0.25: v8.9,16.1 8.9,13.65 9.5,13.05 L-D0.C
  Bottom 0.25: T1-L0.C 9.2,15.2 8.9,15.2 v8.9,16.1
N$13  (via drill 0.4)
  Top 0.25: v24.1,9.8 24.5,10.2 L-D1.A
  Bottom 0.25: v24.1,9.8 22.8,9.8 22.6,10 R2-L1.1
N$14  (via drill 0.4)
  Top 0.25: v18.6,9.3 18,8.7 18,8.45 R1-D0.2
  Bottom 0.25: R1-D0.2 17.75,8.45 v18.6,9.3
N$15  (via drill 0.4)
  Top 0.25: R2-D0.2 11.6,10.6 12,10.6 v12,9.1
  Bottom 0.25: v12,9.1 12.2,9.3 12.6,9.7 12.6,10.35 T2-D0.B
N$16  (via drill 0.35)
  Top 0.25: R12-D0.2 13.35,12.75 v14.2,13.6
  Bottom 0.25: R11-D0.1 16.75,12.65 16.7,12.6 T5-D0.B 14.4,12.6 14.2,12.8 v14.2,13.6
N$17  (via drill 0.4)
  Top 0.25: R13-D0.2 20.2,15.65 20.2,14.7 20.2,13.9 20.2,13.85 20.25,13.85 20.35,13.9 20.35,13.7 20.35,13.8 20.25,13.7 R10-D0.2 20.4,13.55 20.4,13.3 20.7,13 v21.6,13
  Bottom 0.25: T6-D0.B 20.35,12.95 20.65,12.95 20.7,13 v21.6,13
N$18  (via drill 0.4)
  Top 0.25: v23.9,16.1 23.9,13.65 24.5,13.05 L-D1.C
  Bottom 0.25: T1-L1.C 24.2,15.2 23.9,15.2 v23.9,16.1
N$19
  Top 0.25: 15,17.7 13.9,17.7 T3-D0.E 13.8,17.8 | 15,17.7 15.4,17.3 15.4,17.05 R6-D0.1 | R5-D0.2 19.1,17.8 19,17.9 15.2,17.9 15,17.7
N$20  (via drill 0.4)
  Top 0.25: v33.6,9.3 33,8.7 33,8.45 R1-D1.2
  Bottom 0.25: R1-D1.2 32.75,8.45 v33.6,9.3
N$21  (via drill 0.4)
  Top 0.25: R2-D1.2 26.6,10.6 27,10.6 v27,9.1
  Bottom 0.25: v27,9.1 27.2,9.3 27.6,9.7 27.6,10.35 T2-D1.B
N$22
  Top 0.25: 30,17.7 28.9,17.7 T3-D1.E 28.8,17.8 | 30,17.7 30.4,17.3 30.4,17.05 R6-D1.1 | R5-D1.2 34.1,17.8 34,17.9 30.2,17.9 30,17.7
N$23
  Top 0.25: R4-D0.2 13.2,14.2 13.3,14.2 13.3,15.6 13.4,15.7 13.65,15.7 T3-D0.B
N$24
  Top 0.25: R4-D1.2 28.2,14.2 28.3,14.2 28.3,15.6 28.4,15.7 28.65,15.7 T3-D1.B
N$25
  Bottom 0.25: T2-D1.C T1-D1.E
N$26  (via drill 0.4)
  Top 0.25: R7-D1.2 27.95,9.65 27.5,10.1 27.5,13 27.1,13.4 27.1,14.9 26.6,15.4 25.5,15.4 24.9,16 24.4,16.5 24.4,17.8 24.7,18.1 v26.1,18.1
  Bottom 0.25: v26.1,18.1 26.2,18 T4-D1.B
N$27
  Bottom 0.25: T7-D0.B 9.45,7.45 9.4,7.4 7.85,7.4 R14-D0.2
N$28
  Bottom 0.25: T8-D0.B 9.45,11.55 9.5,11.5 9.5,13.45 R15-D0.2
N$29
  Bottom 0.25: T15.B 4.5,16.8 R31.2
N$30  (via drill 0.35)
  Top 0.25: R12-D1.2 28.35,12.75 v29.2,13.6
  Bottom 0.25: R11-D1.1 31.75,12.65 31.7,12.6 T5-D1.B 29.4,12.6 29.2,12.8 v29.2,13.6
N$31  (via drill 0.4)
  Top 0.25: R13-D1.2 35.2,15.65 35.2,14.7 35.2,13.9 35.2,13.85 35.25,13.85 35.35,13.9 35.35,13.7 35.35,13.8 35.25,13.7 R10-D1.2 36.3,13.6 36.6,13.3 v36.6,13
  Bottom 0.25: T6-D1.B 36.4,12.5 36.6,12.7 v36.6,13
N$32
  Bottom 0.25: T7-D1.B 24.45,7.45 24.4,7.4 22.85,7.4 R14-D1.2
N$33
  Bottom 0.25: T8-D1.B 24.45,11.55 24.5,11.5 24.5,13.45 R15-D1.2
N$34
  Bottom 0.25: 37.05,14.1 T1-L2.B 37.75,14.15 38.2,14.6 38.2,16.6 38.2,17.6 38.1,17.7 R1-L2.2
N$35  (via drill 0.4)
  Top 0.25: v39.1,9.8 39.5,10.2 L-D2.A
  Bottom 0.25: v39.1,9.8 37.8,9.8 37.6,10 R2-L2.1
N$36  (via drill 0.4)
  Top 0.25: v38.9,16.1 38.9,13.65 39.5,13.05 L-D2.C
  Bottom 0.25: T1-L2.C 39.2,15.2 38.9,15.2 v38.9,16.1
N$37  (via drill 0.4)
  Top 0.25: v48.6,9.3 48,8.7 48,8.45 R1-D2.2
  Bottom 0.25: R1-D2.2 47.75,8.45 v48.6,9.3
N$38  (via drill 0.4)
  Top 0.25: R2-D2.2 41.6,10.6 42,10.6 v42,9.1
  Bottom 0.25: v42,9.1 42.2,9.3 42.6,9.7 42.6,10.35 T2-D2.B
N$39
  Top 0.25: 45,17.7 43.9,17.7 T3-D2.E 43.8,17.8 | 45,17.7 45.4,17.3 45.4,17.05 R6-D2.1 | R5-D2.2 49.1,17.8 49,17.9 45.2,17.9 45,17.7
N$40
  Top 0.25: R4-D2.2 43.2,14.2 43.3,14.2 43.3,15.6 43.4,15.7 43.65,15.7 T3-D2.B
N$41
  Bottom 0.25: T2-D2.C T1-D2.E
N$42  (via drill 0.4)
  Top 0.25: R7-D2.2 42.95,9.65 42.5,10.1 42.5,13 42.1,13.4 42.1,14.9 41.6,15.4 40.5,15.4 39.9,16 39.4,16.5 39.4,17.8 39.7,18.1 v41.1,18.1
  Bottom 0.25: v41.1,18.1 41.2,18 T4-D2.B
N$43  (via drill 0.35)
  Top 0.25: R12-D2.2 43.35,12.75 v44.2,13.6
  Bottom 0.25: R11-D2.1 46.75,12.65 46.7,12.6 T5-D2.B 44.4,12.6 44.2,12.8 v44.2,13.6
N$44  (via drill 0.4)
  Top 0.25: R13-D2.2 50.2,15.65 50.2,14.7 50.2,13.9 50.2,13.85 50.25,13.85 50.35,13.9 50.35,13.7 50.35,13.8 50.25,13.7 R10-D2.2 51.3,13.6 51.6,13.3 v51.6,13
  Bottom 0.25: T6-D2.B 50.35,12.75 50.5,12.9 50.5,13 v51.6,13
N$45
  Bottom 0.25: T7-D2.B 39.45,7.45 39.4,7.4 37.85,7.4 R14-D2.2
N$46
  Bottom 0.25: T8-D2.B 39.45,11.55 39.5,11.5 39.5,13.45 R15-D2.2
N$47
  Bottom 0.25: 52.05,14.1 T1-L3.B 52.75,14.15 53.2,14.6 53.2,16.6 53.2,17.6 53.1,17.7 R1-L3.2
N$48  (via drill 0.4)
  Top 0.25: v54.1,9.8 54.5,10.2 L-D3.A
  Bottom 0.25: v54.1,9.8 52.8,9.8 52.6,10 R2-L3.1
N$49  (via drill 0.4)
  Top 0.25: v53.9,16.1 53.9,13.65 54.5,13.05 L-D3.C
  Bottom 0.25: T1-L3.C 54.2,15.2 53.9,15.2 v53.9,16.1
N$50  (via drill 0.4)
  Top 0.25: v63.6,9.3 63,8.7 63,8.45 R1-D3.2
  Bottom 0.25: R1-D3.2 62.75,8.45 v63.6,9.3
N$51  (via drill 0.4)
  Top 0.25: R2-D3.2 56.6,10.6 57,10.6 v57,9.1
  Bottom 0.25: v57,9.1 57.2,9.3 57.6,9.7 57.6,10.35 T2-D3.B
N$52
  Top 0.25: 60,17.7 58.9,17.7 T3-D3.E 58.8,17.8 | 60,17.7 60.4,17.3 60.4,17.05 R6-D3.1 | R5-D3.2 64.1,17.8 64,17.9 60.2,17.9 60,17.7
N$53
  Top 0.25: R4-D3.2 58.2,14.2 58.3,14.2 58.3,15.6 58.4,15.7 58.65,15.7 T3-D3.B
N$54
  Bottom 0.25: T2-D3.C T1-D3.E
N$55  (via drill 0.4)
  Top 0.25: R7-D3.2 57.95,9.65 57.5,10.1 57.5,13 57.1,13.4 57.1,14.9 56.6,15.4 55.5,15.4 54.9,16 54.4,16.5 54.4,17.8 54.7,18.1 v56.1,18.1
  Bottom 0.25: v56.1,18.1 56.2,18 T4-D3.B
N$56  (via drill 0.35)
  Top 0.25: R12-D3.2 58.35,12.75 v59.2,13.6
  Bottom 0.25: R11-D3.1 61.75,12.65 61.7,12.6 T5-D3.B 59.4,12.6 59.2,12.8 v59.2,13.6
N$57  (via drill 0.4)
  Top 0.25: v66.1,14.7 65.2,14.7 | 65.2,14.7 65.2,15.65 R13-D3.2 | R10-D3.2 65.25,13.7 65.35,13.8 65.35,13.7 65.35,13.9 65.25,13.85 65.2,13.85 65.2,13.9 65.2,14.7
  Bottom 0.25: v66.1,14.7 66.1,13.15 T6-D3.B
N$58
  Bottom 0.25: T7-D3.B 54.45,7.45 54.4,7.4 52.85,7.4 R14-D3.2
N$59
  Bottom 0.25: T8-D3.B 54.45,11.55 54.5,11.5 54.5,13.45 R15-D3.2
N$61  (1 unrouted)
READ  (via drill 0.35, 0.4)  (2 unrouted)
  Top 0.25: v21.6,5.8 v21.6,2.3 | v51.6,5.8 v51.6,0.6 | v36.3,5.7 v36.3,0.6
  Bottom 0.25: v51.6,0.6 v36.3,0.6 27.2,0.6 26.5,1.3 25.5,2.3 v21.6,2.3 20.9,2.3 20.5,2.7 | R14-D1.1 22.8,5.8 v21.6,5.8 | R14-D3.1 52.8,5.8 v51.6,5.8 | R14-D2.1 37.8,5.7 v36.3,5.7 | 4.5,12.3 R32.1 4.65,11.9 4.9,11.9 5.2,11.6 6.7,10.1 6.7,9.3 6.7,6.4 6.7,6.2 7.1,5.8 7.75,5.8 | 4.5,12.3 2.65,12.3 R6.1 2.4,12.1 2.2,12.3 1.7,12.3 1.4,12.6 1.4,18.4 2,19 T15.C 3.6,19.1 | 4.6,12.2 4.5,12.3 | 7.8,5.4 8.8,4.4 10.3,4.4 18.6,4.4 18.8,4.4 20.5,2.7 | 20.5,2.7 20.7,2.5
RES-0  (via drill 0.4)
  Top 0.25: R6-D0.2 17.8,17 | R13-D0.1 18.6,15.75 17.85,15.75 17.4,16.2 17.4,16.95 R6-D0.2 | v18.5,16.8 17.65,16.8 R6-D0.2
  Bottom 0.25: T4-D0.C 15.8,16 15.8,16.2 15.9,16.3 18,16.3 v18.5,16.8
RES-1  (via drill 0.4)
  Top 0.25: R6-D1.2 32.8,17 | R13-D1.1 33.6,15.75 32.85,15.75 32.4,16.2 32.4,16.95 R6-D1.2 | v33.5,16.8 32.65,16.8 R6-D1.2
  Bottom 0.25: T4-D1.C 30.8,16 30.8,16.2 30.9,16.3 33,16.3 v33.5,16.8
RES-2  (via drill 0.4)
  Top 0.25: R6-D2.2 47.8,17 | R13-D2.1 48.6,15.75 47.85,15.75 47.4,16.2 47.4,16.95 R6-D2.2 | v48.5,16.8 47.65,16.8 R6-D2.2
  Bottom 0.25: T4-D2.C 45.8,16 45.8,16.2 45.9,16.3 48,16.3 v48.5,16.8
RES-3  (via drill 0.4)
  Top 0.25: R6-D3.2 62.8,17 | R13-D3.1 63.6,15.75 62.85,15.75 62.4,16.2 62.4,16.95 R6-D3.2 | v63.5,16.8 62.65,16.8 R6-D3.2
  Bottom 0.25: T4-D3.C 60.8,16 60.8,16.2 60.9,16.3 63,16.3 v63.5,16.8
SET-0  (via drill 0.35)
  Top 0.25: v13.6,9.4 14.8,10.6 14.8,10.75 R12-D0.1 R3-D0.2
  Bottom 0.25: T2-D0.E 14.55,10.75 14.6,10.8 14.6,10.3 v13.6,9.4
SET-1  (via drill 0.35)
  Top 0.25: v28.6,9.4 29.8,10.6 29.8,10.75 R12-D1.1 R3-D1.2
  Bottom 0.25: T2-D1.E 29.55,10.75 29.6,10.8 29.6,10.3 v28.6,9.4
SET-2  (via drill 0.35)
  Top 0.25: v43.6,9.4 44.8,10.6 44.8,10.75 R12-D2.1 R3-D2.2
  Bottom 0.25: T2-D2.E 44.55,10.75 44.6,10.8 44.6,10.3 v43.6,9.4
SET-3  (via drill 0.35)
  Top 0.25: v58.6,9.4 59.8,10.6 59.8,10.75 R12-D3.1 R3-D3.2
  Bottom 0.25: T2-D3.E 59.55,10.75 59.6,10.8 59.6,10.3 v58.6,9.4
WRITE  (via drill 0.35, 0.4)
  Top 0.25: R4-D0.1 11.3,14.15 11.3,12.5 11.45,12.35 R2-D0.1 10.95,12.35 10.6,12 10.6,6.1 v11.5,5.2 12.5,4.2 12.7,4 v12.7,2.4 12.7,1.3 12.1,0.7 2.1,0.7 1.5,1.3 1.5,2.2 CTRL.2 | R4-D1.1 26.3,14.15 26.3,12.5 26.45,12.35 R2-D1.1 25.95,12.35 25.6,12 v25.6,3.1 | R4-D2.1 41.3,14.15 41.3,12.5 41.45,12.35 R2-D2.1 40.95,12.35 40.6,12 40.6,2.2 v40.6,1.3 | R4-D3.1 56.3,14.15 56.3,12.5 56.45,12.35 R2-D3.1 55.95,12.35 55.6,12 55.6,2.2 v55.6,1.1
  Bottom 0.25: 11.6,5.1 v11.5,5.2 11.8,4.9 19.1,4.9 20.7,3.3 20.9,3.1 v25.6,3.1 25.8,3.1 27,1.9 27.6,1.3 v40.6,1.3 51.1,1.3 54,1.3 55.4,1.3 v55.6,1.1 | R4.1 12.7,3.4 | 12.7,3.4 v12.7,2.4 | v12.7,2.4 12.7,1.35 R1.2 | R4.1 12.7,3.4 | R4.1 12.7,3.4 | R4.1 12.65,3.55 12.7,3.6 v12.7,2.4

### Text on the board
tPlace: v0.3 | 3 | 2 | 1 | 0 | +5V | B0 | B1 | B2 | B3 | OUTPUT | +5V | 3 | 2 | 1 | 0 | READ | WRITE
bPlace: 3 | 2 | 1 | 0 | GND | INPUT | GND | 3 | 2 | 1 | 0 | justgeek.de
tStop: NOTES | lizard / 4-bit register